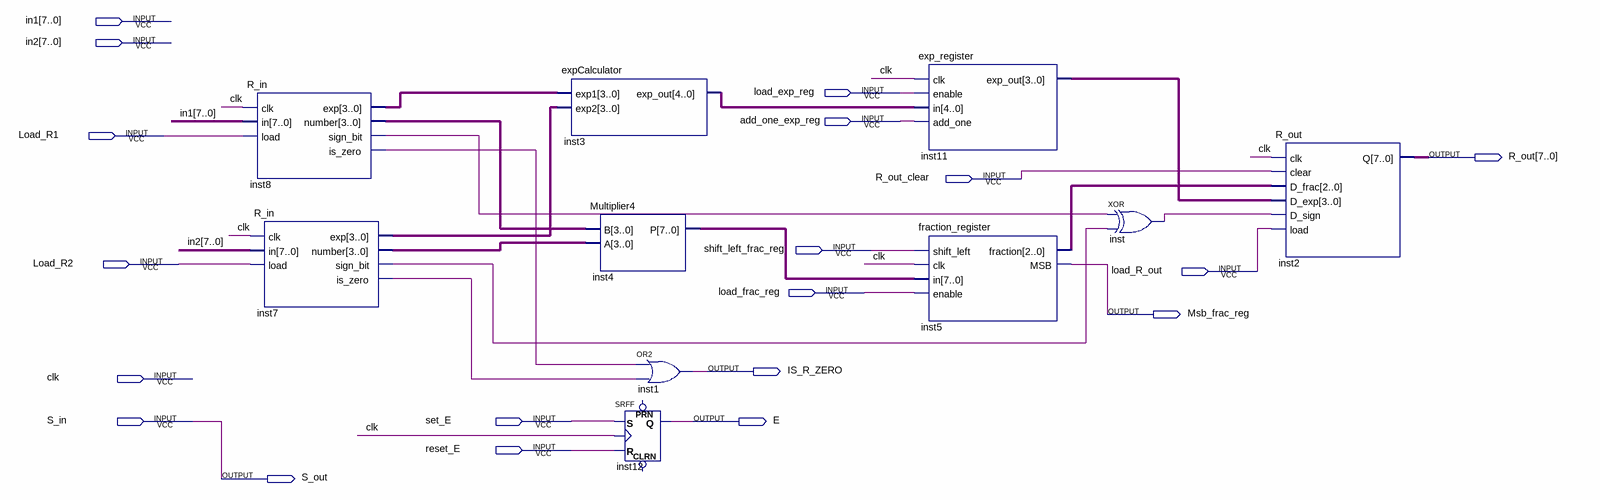
[diagram p0: schematic sheet]
// Quartus schematic DataPath.bdf as structural Verilog: 10 symbols, 19 pins
module DataPath (
  input  [7:0] in1,
  input  [7:0] in2,
  input  load_exp_reg,
  input  add_one_exp_reg,
  input  Load_R1,
  input  R_out_clear,
  input  shift_left_frac_reg,
  input  Load_R2,
  input  load_R_out,
  input  load_frac_reg,
  input  clk,
  input  S_in,
  input  set_E,
  input  reset_E,
  output [7:0] R_out,
  output Msb_frac_reg,
  output IS_R_ZERO,
  output E,
  output S_out
);

  wire inst7_is_zero, inst7_sign_bit, inst8_is_zero, inst8_sign_bit, inst_out;
  wire [2:0] inst5_fraction;
  wire [3:0] inst7_exp, inst7_number, inst8_exp, inst8_number, inst11_exp_out;
  wire [4:0] inst3_exp_out;
  wire [7:0] inst4_p;

  R_in inst8 (
    .clk(clk), .in(in1), .load(Load_R1), .exp(inst8_exp), .number(inst8_number), .sign_bit(inst8_sign_bit),
    .is_zero(inst8_is_zero));
  R_in inst7 (
    .clk(clk), .in(in2), .load(Load_R2), .exp(inst7_exp), .number(inst7_number), .sign_bit(inst7_sign_bit),
    .is_zero(inst7_is_zero));
  expCalculator inst3 (.exp1(inst8_exp), .exp2(inst7_exp), .exp_out(inst3_exp_out));
  Multiplier4 inst4 (.B(inst8_number), .A(inst7_number), .P(inst4_p));
  SRFF inst12 (.S(set_E), .R(reset_E), .CLK(clk), .Q(E));  // open: PRN, CLRN
  or inst1 (IS_R_ZERO, inst8_is_zero, inst7_is_zero);
  exp_register inst11 (
    .clk(clk), .enable(load_exp_reg), .in(inst3_exp_out), .add_one(add_one_exp_reg), .exp_out(inst11_exp_out));
  fraction_register inst5 (
    .shift_left(shift_left_frac_reg), .clk(clk), .in(inst4_p), .enable(load_frac_reg),
    .fraction(inst5_fraction), .MSB(Msb_frac_reg));
  xor inst (inst_out, inst8_sign_bit, inst7_sign_bit);
  R_out inst2 (
    .clk(clk), .clear(R_out_clear), .D_frac(inst5_fraction), .D_exp(inst11_exp_out), .D_sign(inst_out),
    .load(load_R_out), .Q(R_out));

  assign S_out = S_in;
endmodule
